# EAGLE design bike-computer (EAGLE 9.5.1)
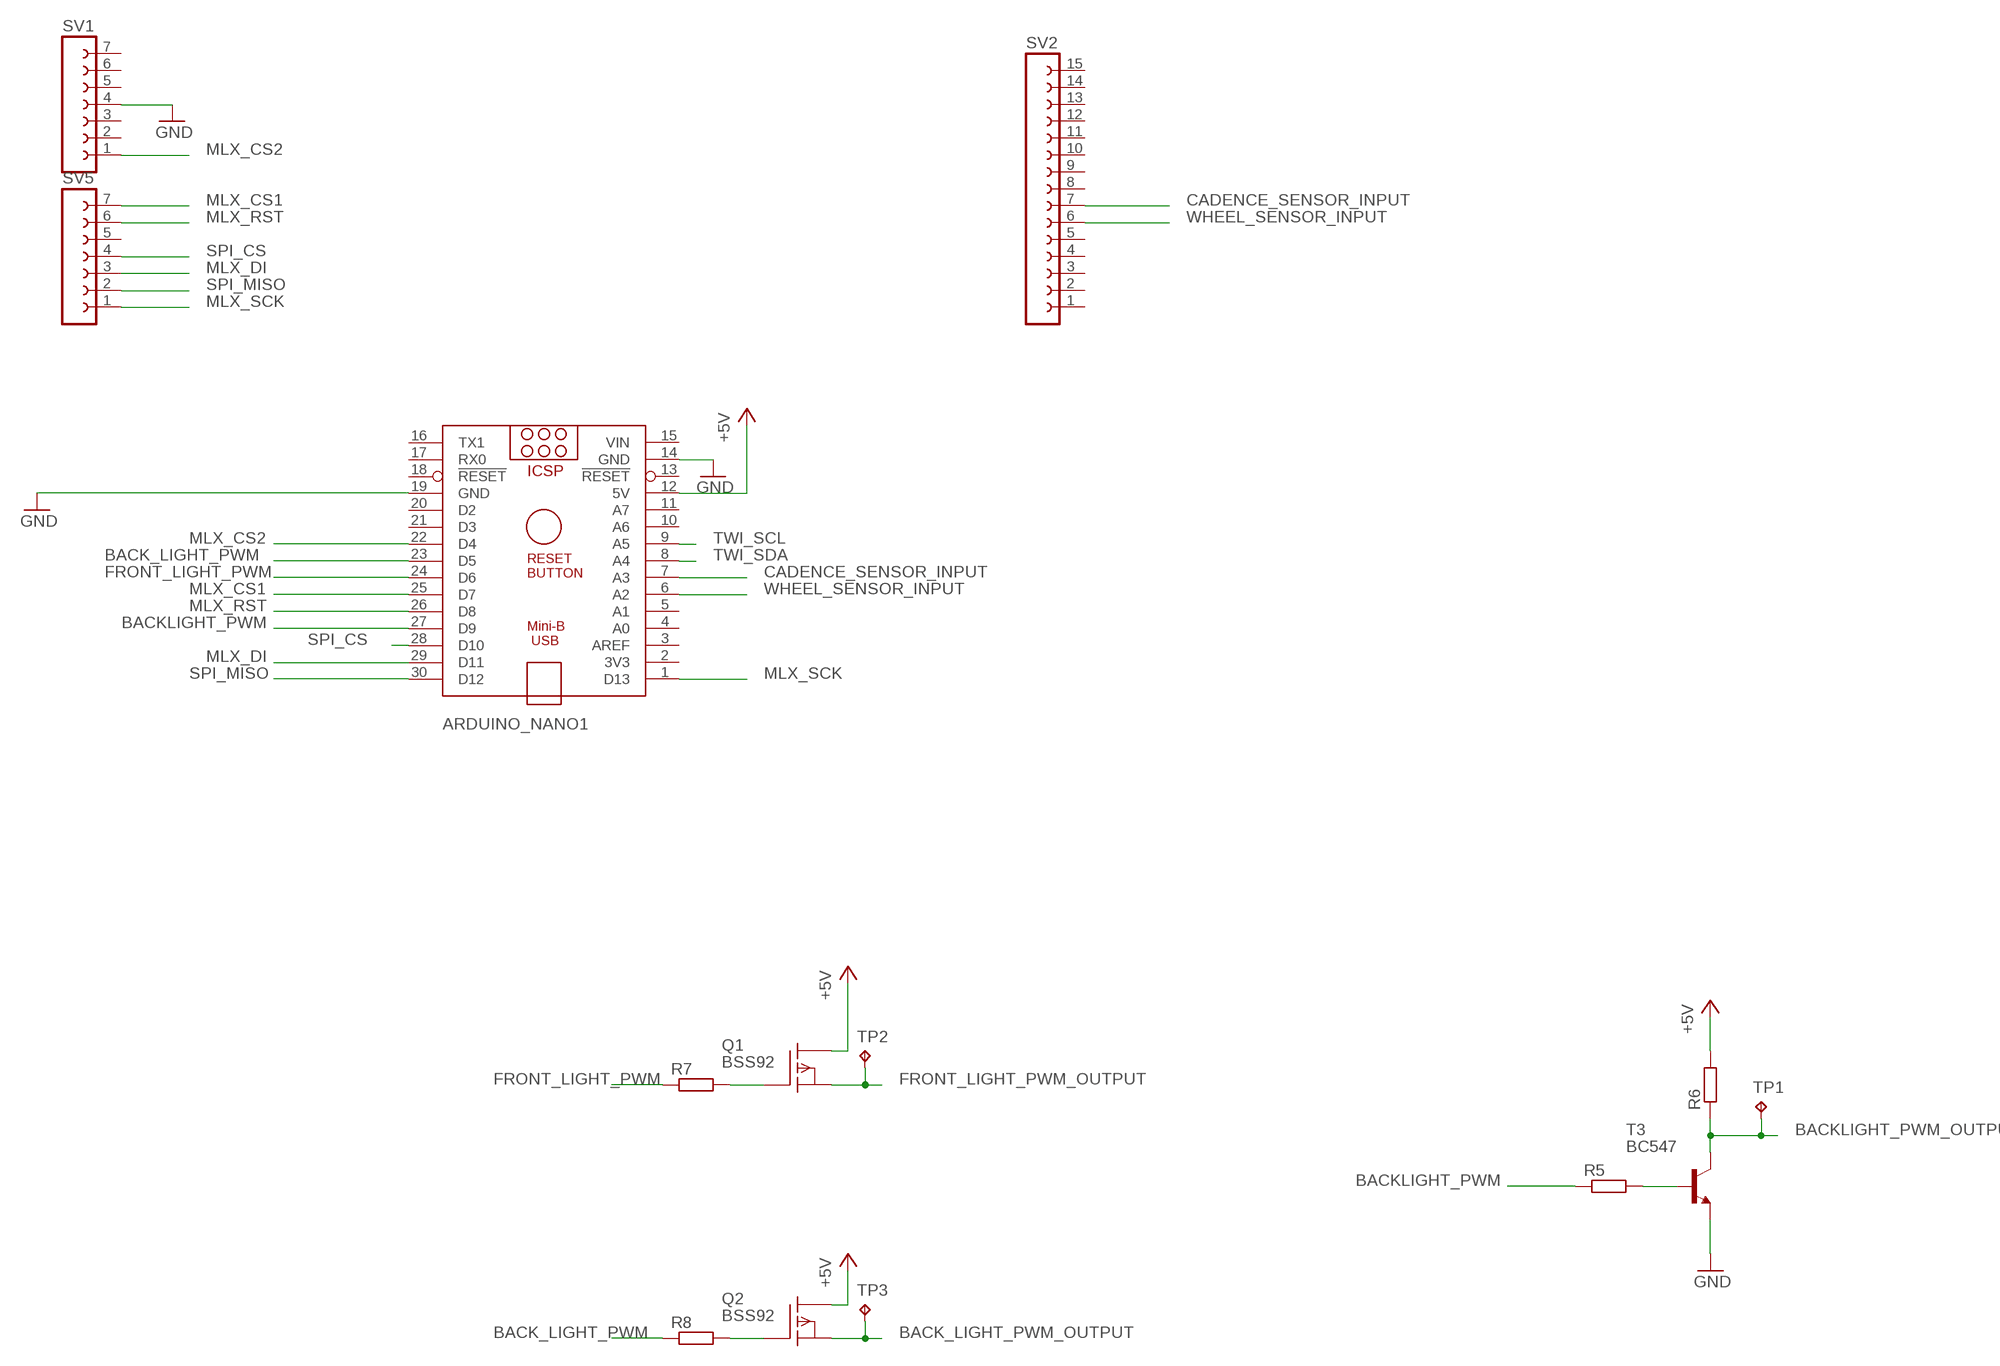
[diagram p0: schematic, sheet 1]

## Parts
ARDUINO_NANO1  ARDUINO_NANO  [ARDUINO_NANO]
Q1  BSS92  [TO92]
Q2  BSS92  [TO92]
R5  R-EU_0204/5  [0204/5]
R6  R-EU_0207/10  [0207/10]
R7  R-EU_0204/5  [0204/5]
R8  R-EU_0204/5  [0204/5]
SV1  FE07-1  [FE07]
SV2  FE15-1  [FE15]
SV5  FE07-1  [FE07]
T3  BC547  [TO92]
TP1  TPPAD1-13  [P1-13]
TP2  TPPAD1-13  [P1-13]
TP3  TPPAD1-13  [P1-13]

## Nets
+5V: ARDUINO_NANO1.12(5V) Q1.2(D) Q2.2(D) R6.2
BACK_LIGHT_PWM: ARDUINO_NANO1.23(D5) R8.1
BACK_LIGHT_PWM_OUTPUT: Q2.3(S) TP3.TP
BACKLIGHT_PWM: ARDUINO_NANO1.27(D9) R5.1
BACKLIGHT_PWM_OUTPUT: R6.1 T3.3(C) TP1.TP
CADENCE_SENSOR_INPUT: ARDUINO_NANO1.7(A3) SV2.7
FRONT_LIGHT_PWM: ARDUINO_NANO1.24(D6) R7.1
FRONT_LIGHT_PWM_OUTPUT: Q1.3(S) TP2.TP
GND: ARDUINO_NANO1.14(GND) ARDUINO_NANO1.19(GND) SV1.4 T3.1(E)
MLX_CS1: ARDUINO_NANO1.25(D7) SV5.7
MLX_CS2: ARDUINO_NANO1.22(D4) SV1.1
MLX_DI: ARDUINO_NANO1.29(D11) SV5.3
MLX_RST: ARDUINO_NANO1.26(D8) SV5.6
MLX_SCK: ARDUINO_NANO1.1(D13) SV5.1
N$4: R5.2 T3.2(B)
N$5: Q1.1(G) R7.2
N$6: Q2.1(G) R8.2
SPI_CS: ARDUINO_NANO1.28(D10) SV5.4
SPI_MISO: ARDUINO_NANO1.30(D12) SV5.2
TWI_SCL: ARDUINO_NANO1.9(A5)
TWI_SDA: ARDUINO_NANO1.8(A4)
WHEEL_SENSOR_INPUT: ARDUINO_NANO1.6(A2) SV2.6
Unconnected: ARDUINO_NANO1.2(3V3) ARDUINO_NANO1.3(AREF) ARDUINO_NANO1.4(A0) ARDUINO_NANO1.5(A1) ARDUINO_NANO1.10(A6) ARDUINO_NANO1.11(A7) ARDUINO_NANO1.13(!RESET) ARDUINO_NANO1.16(TX1) ARDUINO_NANO1.17(RX0) ARDUINO_NANO1.18(!RESET) ARDUINO_NANO1.20(D2) ARDUINO_NANO1.21(D3) SV1.2 SV1.3 SV1.5 SV1.6 SV1.7 SV2.1 SV2.2 SV2.3 SV2.4 SV2.5 SV2.8 SV2.9 SV2.10 SV2.11 SV2.12 SV2.13 SV2.14 SV2.15 SV5.5

## Power pins joined to a net without a drawn wire
VIN: ARDUINO_NANO1.15(VIN)

## Library data of the parts
ARDUINO_NANO1 = ArduinoNanoV30:ARDUINO_NANO: Arduino Nano V3.0 Overview: The Arduino Nano is a small, complete, and breadboard-friendly board based on the ATmega328 (Arduino Nano 3.x) or ATmega168 (Arduino Nano 2.x). It has more or less the same functionality of the Arduino Duemilanove, but in a different package. It lacks only a DC power jack, and works with a Mini-B USB cable instead of a standard one. The Nano was designed and is being produced by Gravitech. Specifications: Microcontroller Atmel ATmega168 or ATmega328 Operating Voltage (logic level) 5 V Input Voltage (recommended) 7-12 V Input Voltage (limits) 6-20 V Digital I/O Pins 14 (of which 6 provide PWM output) Analog Input Pins 8 DC Current per I/O Pin 40 mA Flash Memory 16 KB (ATmega168) or 32 KB (ATmega328) of which 2 KB used by bootloader SRAM 1 KB (ATmega168) or 2 KB (ATmega328) EEPROM 512 bytes (ATmega168) or 1 KB (ATmega328) Clock Speed 16 MHz Dimensions 0.73" x 1.70" Length 45 mm Width 18 mm Weigth 5 g Power: The Arduino Nano can be powered via the Mini-B USB connection, 6-20V unregulated external power supply (pin 30), or 5V regulated external power supply (pin 27). The power source is automatically selected to the highest voltage source. Memory: The ATmega168 has 16 KB of flash memory for storing code (of which 2 KB is used for the bootloader); the ATmega328 has 32 KB, (also with 2 KB used for the bootloader). The ATmega168 has 1 KB of SRAM and 512 bytes of EEPROM (which can be read and written with the EEPROM library); the ATmega328 has 2 KB of SRAM and 1 KB of EEPROM. Input and Output: Each of the 14 digital pins on the Nano can be used as an input or output, using pinMode(), digitalWrite(), and digitalRead() functions. They operate at 5 volts. Each pin can provide or receive a maximum of 40 mA and has an internal pull-up resistor (disconnected by default) of 20-50 kOhms. In addition, some pins have specialized functions. Visit Arduino - ArduinoBoardNano <https://www.arduino.cc/en/Main/ArduinoBoardNano>
Q1 Q2 = transistor-fet:BSS92: P-Channel Enhancement MOSFET -200V; -0,15A; 11Ohm
R5-R8 = rcl:R-EU_: RESISTOR, European symbol; SPICEPREFIX: R
SV1 SV5 = con-lsta:FE07-1: FEMALE HEADER; OC_FARNELL: unknown; OC_NEWARK: unknown
SV2 = con-lsta:FE15-1: FEMALE HEADER; OC_FARNELL: unknown; OC_NEWARK: unknown
T3 = transistor:BC547: NPN TRANSISTOR
TP1-TP3 = testpad:TP: Test pad

## Board
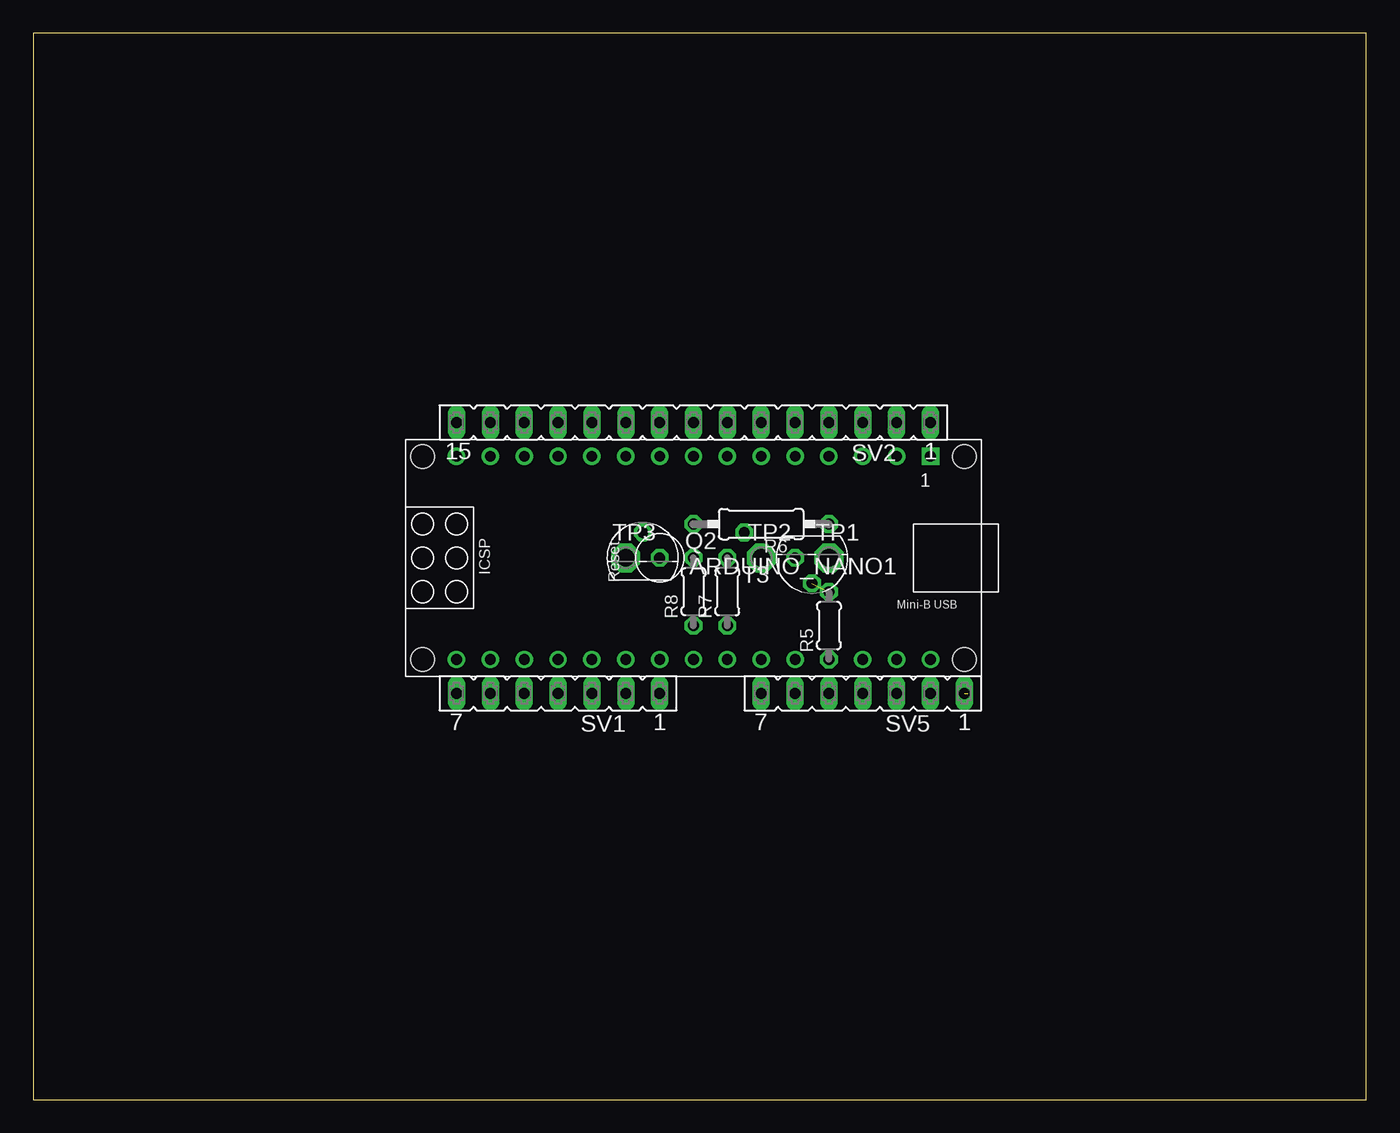
[diagram p1: board, top side]
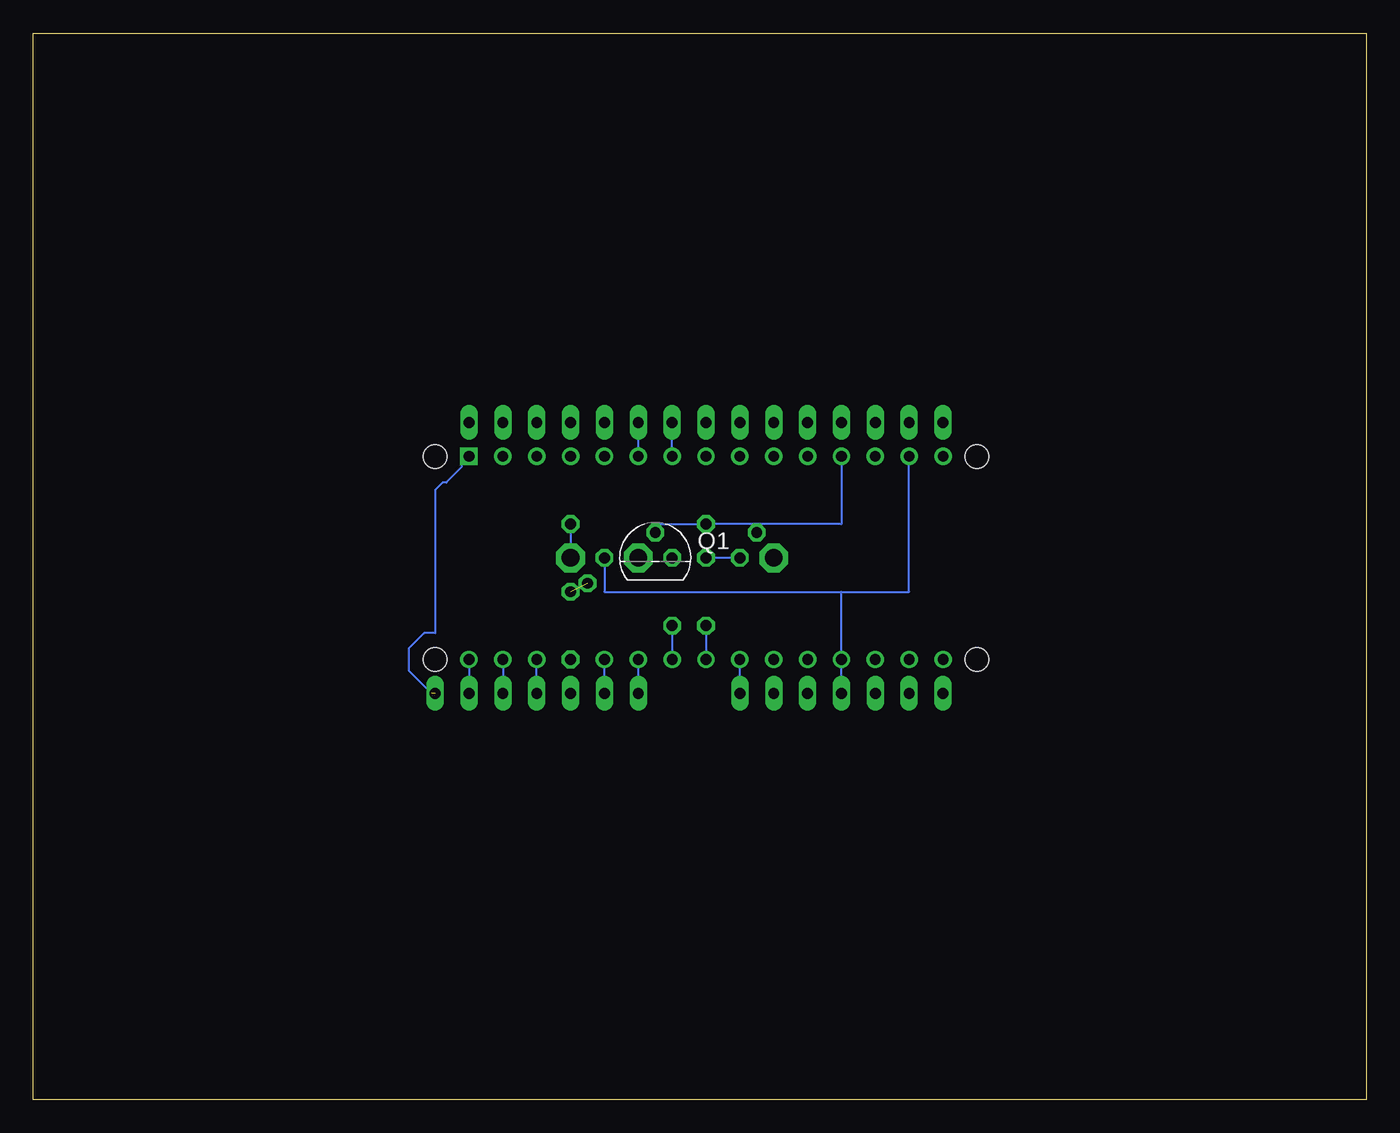
[diagram p2: board, bottom side, seen from below]

Size 100 x 80 mm. Coordinates in mm from the lower left corner, seen from the top.
Outline: 0,0 100,0 100,80 0,80 0,0
Copper layers (1*16): Top 0.035mm / dielectric 1.5mm / Bottom 0.035mm
Design rules "default": minimum track width 6mil, minimum drill 0.35mm, track to track 6mil, track to pad 6mil, pad to pad 6mil, via to via 6mil, smd to smd 6mil, copper to edge 40mil, drill to drill 6mil, minimum pad ring 10mil, minimum via ring 8mil, stop-mask expansion 4mil, vias tented up to drill 0mil, thermal gap 10mil

### Footprints (pad centres in the part's own frame; a part is rotated, then mirrored left to right if it is on the bottom)
ARDUINO_NANO = drill 0.8 square: 1 -20.32,-7.62 | drill 0.8: 2 -17.78,-7.62; 3 -15.24,-7.62; 4 -12.7,-7.62; 5 -10.16,-7.62; 6 -7.62,-7.62; 7 -5.08,-7.62; 8 -2.54,-7.62; 9 0,-7.62; 10 2.54,-7.62; 11 5.08,-7.62; 12 7.62,-7.62; 13 10.16,-7.62; 14 12.7,-7.62; 15 15.24,-7.62; 16 15.24,7.62; 17 12.7,7.62; 18 10.16,7.62; 19 7.62,7.62; 20 5.08,7.62; 21 2.54,7.62; 22 0,7.62; 23 -2.54,7.62; 24 -5.08,7.62; 25 -7.62,7.62; 26 -10.16,7.62; 27 -12.7,7.62; 28 -15.24,7.62; 29 -17.78,7.62; 30 -20.32,7.62 | hole 1.778: -22.86,-7.62; -22.86,7.62; 17.78,7.62; 17.78,-7.62
TO92 = drill 0.813 octagon: 1 1.27,0; 2 0,1.905; 3 -1.27,0
0204/5 = drill 0.813 octagon: 1 -2.54,0; 2 2.54,0
0207/10 = drill 0.813 octagon: 1 -5.08,0; 2 5.08,0
FE07 = drill 0.813 long: 1 -7.62,0; 2 -5.08,0; 3 -2.54,0; 4 0,0; 5 2.54,0; 6 5.08,0; 7 7.62,0
FE15 = drill 0.813 long: 1 -17.78,0; 2 -15.24,0; 3 -12.7,0; 4 -10.16,0; 5 -7.62,0; 6 -5.08,0; 7 -2.54,0; 8 0,0; 9 2.54,0; 10 5.08,0; 11 7.62,0; 12 10.16,0; 13 12.7,0; 14 15.24,0; 15 17.78,0
P1-13 = drill 1.321 pad 2.159 octagon: TP 0,0

### Placement (x,y rotation side)
ARDUINO_NANO1  46.99,40.64 180 top
Q1  53.34,40.64 0 bottom
Q2  45.72,40.64 0 top
R5  59.69,35.56 90 top
R6  54.61,43.18 180 top
R7  52.07,38.1 90 top
R8  49.53,38.1 90 top
SV1  39.37,30.48 180 top
SV2  49.53,50.8 180 top
SV5  62.23,30.48 180 top
T3  58.42,40.64 180 top
TP1  59.69,40.64 0 top
TP2  54.61,40.64 0 top
TP3  44.45,40.64 0 top

### Tracks (layer width: path | path; a pad name or v marks a point on that pad's centre or on a via)
+5V
  Bottom 0.152: ARDUINO_NANO1.12 39.37,43.18 45.72,43.18 | 45.72,43.18 R6.2 53.34,43.18 Q1.2 | Q2.2 45.72,43.18
BACK_LIGHT_PWM
  Bottom 0.152: R8.1 ARDUINO_NANO1.23
BACKLIGHT_PWM_OUTPUT
  Bottom 0.152: R6.1 TP1.TP
CADENCE_SENSOR_INPUT
  Bottom 0.152: ARDUINO_NANO1.7 SV2.7
FRONT_LIGHT_PWM
  Bottom 0.152: R7.1 ARDUINO_NANO1.24
GND
  Bottom 0.152: T3.1 57.15,38.1 39.37,38.1 | 39.37,38.1 34.29,38.1 ARDUINO_NANO1.14 | 39.37,38.1 ARDUINO_NANO1.19 SV1.4
MLX_CS1
  Bottom 0.152: SV5.7 ARDUINO_NANO1.25
MLX_CS2
  Bottom 0.152: SV1.1 ARDUINO_NANO1.22
MLX_DI
  Bottom 0.152: ARDUINO_NANO1.29 SV5.3
MLX_RST
  Bottom 0.152: SV5.6 ARDUINO_NANO1.26
MLX_SCK  (1 unrouted)
  Bottom 0.152: ARDUINO_NANO1.1 67.87,47.7 67.87,47.44 69.03,46.28 69.29,46.28 69.85,45.72 69.85,35 70.67,35 71.83,33.84 71.83,32.2 70.11,30.48
N$4  (1 unrouted)
N$6
  Bottom 0.152: Q2.1 R8.2
SPI_CS
  Bottom 0.152: SV5.4 ARDUINO_NANO1.28
SPI_MISO
  Bottom 0.152: ARDUINO_NANO1.30 SV5.2
WHEEL_SENSOR_INPUT
  Bottom 0.152: ARDUINO_NANO1.6 SV2.6